# Altium project power.PrjPcb
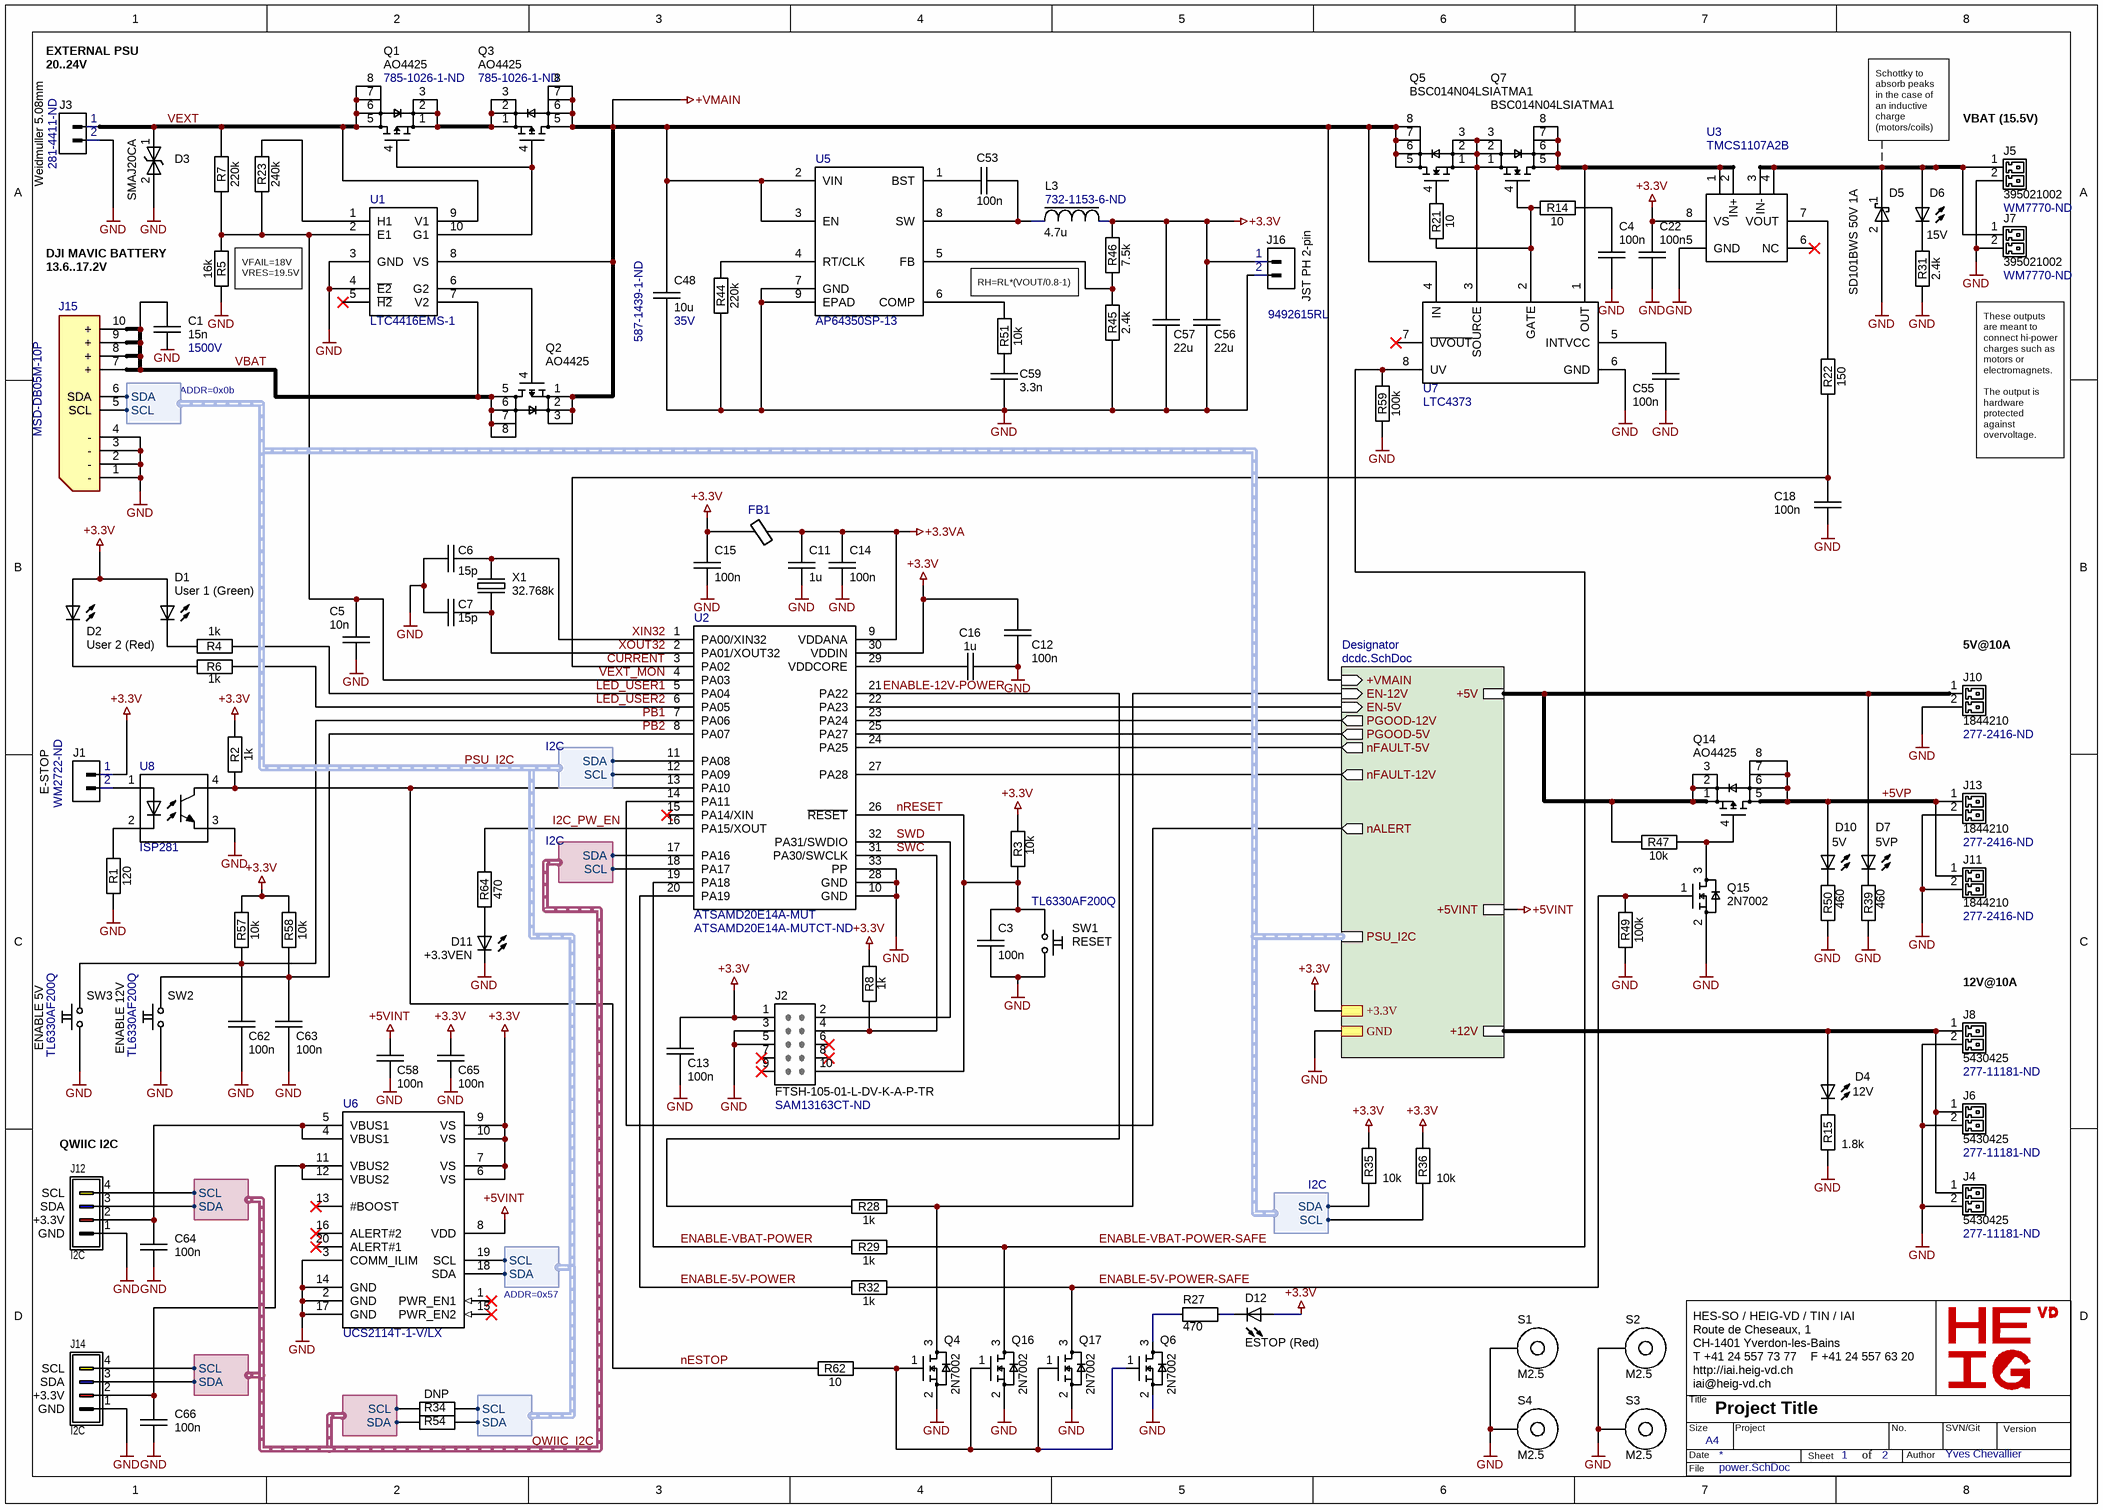
[diagram p0: power.SchDoc]
ProjectAuthor: Prof. Yves Chevallier; ProjectiAi: CRH2022-PWR; ProjectNumber: 165465; ProjectRevision: 0.3.0
2 sheets, 197 parts. Net scope: strictly hierarchical (ports join the sheet entries above them; power ports are local).
Board file: psu.PcbDoc
Sheets:
  power.SchDoc
    Designator = dcdc.SchDoc

## Sheet power.SchDoc: Project Title
size A3; ApprovedBy: Yves Chevallier; CheckedBy: Yves Chevallier; Author: Yves Chevallier; CompanyName: EPFL; DrawnBy: Yves Chevallier; Engineer: Yves Chevallier; Organization: EPFL; Address1: EPFL; Address2: CH1015 Lausanne; Address3: +41(0)21 693 36 98; Address4: +41(0)21 693 26 00; DocumentNumber: ABC.00.0000.000.0; Revision: v1.0; SheetNumber: 1; SheetTotal: 2; DrawnByDate: 2000-01-01; ExecutionWarrantDate: 2000-01-01; ExecutionWarrant: Yves Chevallier; Context: Confidential; PageSetup: Record=PageOptions|CenterHorizontal=True|CenterVertical=False|PrintScale=0.97|XCorrection=1.00|YCorrection=1.00|PrintKind=0|BorderSize=5000000|LeftOffset=0|BottomOffset=0|Orientation=2|PaperLength=1000|PaperWidth=1000|Scale=100|PaperSource=262|PrintQuality=600|MediaType=1|DitherType=10|PaperKind=A4|PrintScaleMode=1; EngineerDate: 2000-01-01; CheckedByDate: 2000-01-01; ProjectName: PRJ

### Parts
C1  15n  Voltage: 1500V  [SM/C1812]
C3  100n  [SM/C0603]
C4  100n  [SM/C0603]
C5  10n  [SM/C0603]
C6  15p  [SM/C0603]
C7  15p  [SM/C0603]
C11  1u  [SM/C0603]
C12  100n  [SM/C0603]
C13  100n  [SM/C0603]
C14  100n  [SM/C0603]
C15  100n  [SM/C0603]
C16  1u  [SM/C0603]
C18  100n  [SM/C0603]
C22  100n  [SM/C0603]
C48  10u  Supplier Part Number 1: 587-1439-1-ND  Voltage: 35V  [SM/C1210]
C53  100n  [SM/C0603]
C55  100n  [SM/C0603]
C56  22u  [SM/C1210]
C57  22u  [SM/C1210]
C58  100n  [SM/C0603]
C59  3.3n  [SM/C0603]
C62  100n  [SM/C0603]
C63  100n  [SM/C0603]
C64  100n  [SM/C0603]
C65  100n  [SM/C0603]
C66  100n  [SM/C0603]
D1  User 1 (Green)  [SM/LED0603]
D2  User 2 (Red)  [SM/LED0603]
D3  SMAJ20CA  [DO214AC]
D4  12V  [SM/LED0603]
D5  SD101BWS 50V 1A  [SOD323]
D6  15V  [SM/LED0603]
D7  5VP  [SM/LED0603]
D10  5V  [SM/LED0603]
D11  +3.3VEN  [SM/LED0603]
D12  ESTOP (Red)  [SM/LED0603]
FB1  250@1MHz  [SM/L0603]  (value not drawn)
J1  E-STOP  Supplier Part Number 1: WM2722-ND  [CONN/HEADER/2.54mm/2POS]
J2  FTSH-105-01-L-DV-K-A-P-TR  Supplier Part Number 1: SAM13163CT-ND  [SAMTEC_FTSH-105-01-L-DV-K-A-P]
J3  Weidmuller 5.08mm  Supplier Part Number 1: 281-4411-ND  [CONN 2POS WEIDMULLER 5.08mm]
J4  5430425  Supplier Part Number 1: 277-11181-ND  [CONN2/PHOENIX/MC 1.5-2-G-3.5-GRAY]
J5  395021002  Supplier Part Number 1: WM7770-ND  [CONN2/PHOENIX/MC 1.5-2-G-3.5-BLACK]
J6  5430425  Supplier Part Number 1: 277-11181-ND  [CONN2/PHOENIX/MC 1.5-2-G-3.5-GRAY]
J7  395021002  Supplier Part Number 1: WM7770-ND  [CONN2/PHOENIX/MC 1.5-2-G-3.5-BLACK]
J8  5430425  Supplier Part Number 1: 277-11181-ND  [CONN2/PHOENIX/MC 1.5-2-G-3.5-GRAY]
J10  1844210  Supplier Part Number 1: 277-2416-ND  [CONN2/PHOENIX/MC 1.5-2-G-3.5]
J11  1844210  Supplier Part Number 1: 277-2416-ND  [CONN2/PHOENIX/MC 1.5-2-G-3.5]
J12  I2C  [QWIIC-SM04B-SRSS-TB]
J13  1844210  Supplier Part Number 1: 277-2416-ND  [CONN2/PHOENIX/MC 1.5-2-G-3.5]
J14  I2C  [QWIIC-SM04B-SRSS-TB]
J15  MSD-DB05M-10P  [CONN DJI-Mavic2]
J16  JST PH 2-pin  Supplier Part Number 1: 9492615RL  [JST_S2B-PH-SM4-TB(LF)(SN)]
L3  4.7u  Supplier Part Number 1: 732-1153-6-ND  [IND_311470_WRE]
Q1  AO4425  Supplier Part Number 1: 785-1026-1-ND  [SOIC8]
Q2  AO4425  [SOIC8]
Q3  AO4425  Supplier Part Number 1: 785-1026-1-ND  [SOIC8]
Q4  2N7002  [SOT23-3]
Q5  BSC014N04LSIATMA1  [PG-TDSON-8_INF]
Q6  2N7002  [SOT23-3]
Q7  BSC014N04LSIATMA1  [PG-TDSON-8_INF]
Q14  AO4425  [SOIC8]
Q15  2N7002  [SOT23-3]
Q16  2N7002  [SOT23-3]
Q17  2N7002  [SOT23-3]
R1  120  [SM/R0603]
R2  1k  [SM/R0603]
R3  10k  [SM/R0603]
R4  1k  [SM/R0603]
R5  16k  [SM/R0603]
R6  1k  [SM/R0603]
R7  220k  [SM/R0603]
R8  1k  [SM/R0603]
R14  10  [SM/R0603]
R15  1.8k  [SM/R0603]
R21  10  [SM/R0603]
R22  150  [SM/R0603]
R23  240k  [SM/R0603]
R27  470  [SM/R0603]
R28  1k  [SM/R0603]
R29  1k  [SM/R0603]
R31  2.4k  [SM/R0603]
R32  1k  [SM/R0603]
R34  DNP  [SM/R0603]  (value not drawn)
R35  10k  [SM/R0603]
R36  10k  [SM/R0603]
R39  460  [SM/R0603]
R44  220k  [SM/R0603]
R45  2.4k  [SM/R0603]
R46  7.5k  [SM/R0603]
R47  10k  [SM/R0603]
R49  100k  [SM/R0603]
R50  460  [SM/R0603]
R51  10k  [SM/R0603]
R54  DNP  [SM/R0603]
R57  10k  [SM/R0603]
R58  10k  [SM/R0603]
R59  100k  [SM/R0603]
R62  10  [SM/R0603]
R64  470  [SM/R0603]
S1  M2.5  [HW/HOLE/M2.5/VIA]  (no BOM)
S2  M2.5  [HW/HOLE/M2.5/VIA]  (no BOM)
S3  M2.5  [HW/HOLE/M2.5/VIA]  (no BOM)
S4  M2.5  [HW/HOLE/M2.5/VIA]  (no BOM)
SW1  RESET  value TL6330AF200Q  [PB TL6330]
SW2  ENABLE 12V  value TL6330AF200Q  [PB TL6330]
SW3  ENABLE 5V  value TL6330AF200Q  [PB TL6330]
U1  LTC4416EMS-1  [MSOP10]
U2  ATSAMD20E14A-MUT  Supplier Part Number 1: ATSAMD20E14A-MUTCT-ND  [QFN32_5X5MC_MCH]
U3  TMCS1107A2B  [SOIC8]
U5  AP64350SP-13  [SOIC8-POWER_PAD]
U6  UCS2114T-1-V/LX  [IC_UCS2114-1-V/LX]
U7  LTC4373  [MSOP8]
U8  ISP281  [SOIC-4]
X1  32.768k  [RT3215-32.768-12.5]

### Sub-sheets
Designator = dcdc.SchDoc: PSU_I2C (harness I2C), nFAULT-5V (out), +VMAIN (in), nFAULT-12V (out), PGOOD-12V (out), PGOOD-5V (out), nALERT (out), +12V, +5V, EN-12V (in), EN-5V (in), +5VINT, +3.3V, GND

### Harnesses
I2C: SDA, SCL
I2C: SCL, SDA

### Nets
+3.3V: C12.2 C13.2 C15.2 C22.2 C56.1 C57.1 C65.2 D1.1 D2.1 D12.1 FB1.2 J1.1 J2.1 J16.1 L3.1 R2.2 R3.2 R8.2 R35.2 R36.2 R46.2 R57.2 R58.2 U2.30(VDDIN) U3.8(VS) U6.6(VS) U6.7(VS) U6.9(VS) U6.10(VS) ; sheet Designator/+3.3V
+3.3VA: C11.2 C14.2 FB1.1 U2.9(VDDANA)
+5V: D7.1 J10.1 Q14.1(S) Q14.2(S) Q14.3(S) R47.2 ; sheet Designator/+5V
+5VINT: C58.2 U6.8(VDD) ; sheet Designator/+5VINT
+12V: D4.1 J4.1 J6.1 J8.1 ; sheet Designator/+12V
+VMAIN: C48.1 Q2.1(S) Q2.2(S) Q2.3(S) Q3.5(D) Q3.6(D) Q3.7(D) Q3.8(D) Q5.5(D) Q5.6(D) Q5.7(D) Q5.8(D) U1.8(VS) U5.2(VIN) U5.3(EN) U7.4(IN) ; sheet Designator/+VMAIN
GND: C1.1 C3.1 C4.1 C5.1 C6.1 C7.1 C11.1 C12.1 C13.1 C14.1 C15.1 C16.1 C18.1 C22.1 C48.2 C55.1 C56.2 C57.2 C58.1 C59.1 C62.1 C63.1 C64.1 C65.1 C66.1 D3.2 D5.2(ANODE) D11.2 J2.3 J2.5 J3.2 J4.2 J5.2 J6.2 J7.2 J8.2 J10.2 J11.2 J12.1(GND) J13.2 J14.1(GND) J15.1(-) J15.2(-) J15.3(-) J15.4(-) J16.2 Q4.2(VCC) Q6.2(VCC) Q15.2(VCC) Q16.2(VCC) Q17.2(VCC) R1.1 R5.1 R15.1 R31.1 R39.1 R44.1 R45.1 R49.1 R50.1 R59.1 S1.1 S2.1 S3.1 S4.1 SW1.1 SW2.1 SW3.1 U1.3(GND) U1.4(~{E2}) U2.10(GND) U2.28(GND) U2.33(PP) U3.5(GND) U5.7(GND) U5.9(EPAD) U6.2(GND) U6.3(COMM_ILIM) U6.14(GND) U6.17(GND) U7.6(GND) U8.3(E) ; sheet Designator/GND
+5VP: D10.1 J11.1 J13.1 Q14.5(D) Q14.6(D) Q14.7(D) Q14.8(D)
CURRENT: C18.2 R22.2 U2.3(PA02)
EN-5V: U2.22(PA23) ; sheet Designator/EN-5V
EN-12V: Q4.3(VCC) R28.1 ; sheet Designator/EN-12V
ENABLE-5V-POWER: R32.2 U2.20(PA19)
ENABLE-5V-POWER-SAFE: Q15.1(VCC) Q17.3(VCC) R32.1 R49.2
ENABLE-12V-POWER: R28.2 U2.21(PA22)
ENABLE-VBAT-POWER: R29.2 U2.19(PA18)
ENABLE-VBAT-POWER-SAFE: Q16.3(VCC) R29.1 R59.2 U7.8(UV)
I2C_PW_EN: R64.2 U2.16(PA15/XOUT)
LED_USER1: R4.1 U2.5(PA04)
LED_USER2: R6.1 U2.6(PA05)
nALERT: U2.14(PA11) ; sheet Designator/nALERT
nESTOP: R2.1 R62.2 U2.13(PA10) U8.4(C)
nFAULT-5V: U2.24(PA25) ; sheet Designator/nFAULT-5V
nFAULT-12V: U2.27(PA28) ; sheet Designator/nFAULT-12V
nRESET: C3.2 J2.10 R3.1 SW1.2 U2.26(~{RESET})
PB1: C62.2 R57.1 SW3.2 U2.7(PA06)
PB2: C63.2 R58.1 SW2.2 U2.8(PA07)
PGOOD-5V: U2.25(PA27) ; sheet Designator/PGOOD-5V
PGOOD-12V: U2.23(PA24) ; sheet Designator/PGOOD-12V
PSU_I2C.SCL: J15.5(SCL) R34.1 R36.1 U2.12(PA09) U6.19(SCL) ; sheet Designator/PSU_I2C.SCL
PSU_I2C.SDA: J15.6(SDA) R35.1 R54.1 U2.11(PA08) U6.18(SDA) ; sheet Designator/PSU_I2C.SDA
QWIIC_I2C.SCL: J12.4(SCL) J14.4(SCL) R34.2 U2.18(PA17) ; harness I2C.SCL
QWIIC_I2C.SDA: J12.3(SDA) J14.3(SDA) R54.2 U2.17(PA16) ; harness I2C.SDA
SWC: J2.4 R8.1 U2.31(PA30/SWCLK)
SWD: J2.2 U2.32(PA31/SWDIO)
VBAT: C1.2 J15.7(+) J15.8(+) J15.9(+) J15.10(+) Q2.5(D) Q2.6(D) Q2.7(D) Q2.8(D) U1.7(V2)
VEXT: D3.1 J3.1 Q1.5(D) Q1.6(D) Q1.7(D) Q1.8(D) R7.2 U1.9(V1)
VEXT_MON: C5.2 R5.2 R7.1 R23.1 U1.2(E1) U2.4(PA03)
XIN32: C6.2 U2.1(PA00/XIN32) X1.2
XOUT32: C7.2 U2.2(PA01/XOUT32) X1.1
NetC4_2: C4.2 R14.1
NetC16_2: C16.2 U2.29(VDDCORE)
NetC53_1: C53.1 U5.1(BST)
NetC53_2: C53.2 L3.2 U5.8(SW)
NetC55_2: C55.2 U7.5(INTVCC)
NetC59_2: C59.2 R51.1
NetC64_2: C64.2 J12.2(+3.3V) U6.4(VBUS1) U6.5(VBUS1)
NetC66_2: C66.2 J14.2(+3.3V) U6.11(VBUS2) U6.12(VBUS2)
NetD1_2: D1.2 R4.2
NetD2_2: D2.2 R6.2
NetD4_2: D4.2 R15.2
NetD5_1: D5.1(CATHODE) D6.1 J5.1 J7.1 U3.3(IN-) U3.4(IN-)
NetD6_2: D6.2 R31.2
NetD7_2: D7.2 R39.2
NetD10_2: D10.2 R50.2
NetD11_1: D11.1 R64.1
NetD12_2: D12.2 R27.1
NetJ1_2: J1.2 U8.1(A)
NetQ1_1: Q1.1(S) Q1.2(S) Q1.3(S) Q3.1(S) Q3.2(S) Q3.3(S)
NetQ1_4: Q1.4(Gate) Q3.4(Gate) U1.10(G1)
NetQ2_4: Q2.4(Gate) U1.6(G2)
NetQ4_1: Q4.1(VCC) Q6.1(VCC) Q16.1(VCC) Q17.1(VCC) R62.1
NetQ5_1: Q5.1(S) Q5.2(S) Q5.3(S) Q7.1(S) Q7.2(S) Q7.3(S) U7.3(SOURCE)
NetQ5_4: Q5.4(Gate) R21.2
NetQ6_3: Q6.3(VCC) R27.2
NetQ7_4: Q7.4(Gate) R14.2 R21.1 U7.2(GATE)
NetQ7_5: Q7.5(D) Q7.6(D) Q7.7(D) Q7.8(D) U3.1(IN+) U3.2(IN+) U7.1(OUT)
NetQ14_4: Q14.4(Gate) Q15.3(VCC) R47.1
NetR1_2: R1.2 U8.2(K)
NetR22_1: R22.1 U3.7(VOUT)
NetR23_2: R23.2 U1.1(H1)
NetR44_2: R44.2 U5.4(RT/CLK)
NetR45_2: R45.2 R46.1 U5.5(FB)
NetR51_2: R51.2 U5.6(COMP)

Not connected (* = marked no-connect by the designer): J2 6* 7* 8* 9*; U1 5(~{H2})*; U2 15(PA14/XIN)*; U3 6(NC)*; U6 1(PWR_EN1)* 13(#BOOST)* 15(PWR_EN2)* 16(ALERT#2)* 20(ALERT#1)*; U7 7(~{UVOUT})*

### Buses and harness runs
harness PSU_I2C = sheet Designator/PSU_I2C

### Notes on the sheet
- EXTERNAL PSU
- 20..24V
- Schottky to absorb peaks in the case of an inductive charge (motors/coils)
- (near J5) VBAT (15.5V)
- DJI MAVIC BATTERY
- 13.6..17.2V
- (near R5) VFAIL=18V
  VRES=19.5V
- RH=RL*(VOUT/0.8-1)
- (near C1) ADDR=0x0b
- These outputs are meant to connect hi-power charges such as motors or electromagnets.
  The output is hardware protected against overvoltage.
- (near J10) 5V@10A
- (near J8) 12V@10A
- (near J12) QWIIC I2C
- (near U6) ADDR=0x57
- HES-SO / HEIG-VD / TIN / IAI
  Route de Cheseaux, 1
  CH-1401 Yverdon-les-Bains
  T +41 24 557 73 77    F +41 24 557 63 20
  http://iai.heig-vd.ch
  iai@heig-vd.ch
- Title
- Size
- Date
- A4
- Project
- Sheet
- of
- No.
- Author
- SVN/Git
- Version
- File

### Library data of the parts
C1 = C: 0.015 µF ±10% 1500V (1.5kV) Ceramic Capacitor X7R 1812 (4532 Metric); Dielectric: X7R; Supplier 1: Digi-Key; Supplier Part Number 1: 478-10711-1-ND; Value: 15n
C3 C5-C7 C11-C16 C58 C62-C66 = C: Chip Capacitor; Voltage: 16V; Dielectric: X7R
  C3 C13 C64 C66: Value: 100n
  C5: Value: 10n
  C6 C7: Value: 15p
  C11: Supplier 2 Part Number: 1292-1393-1-ND; Supplier 2: Digi-Key; Value: 1u
  C12 C14 C15 C58 C62 C63 C65: Supplier 2 Part Number: 1292-1393-1-ND; Supplier 2: Digi-Key; Value: 100n
  C16: Value: 1u
C4 C18 C22 C53 C55 C59 = C: CL32B226KPJVPNE; Supplier 1: Digi-Key; Supplier Part Number 1: 490-1719-1-ND
  C4 C18 C22 C53 C55: Value: 100n
  C59: Value: 3.3n
C48 = C: 10µF ±10% 25V Ceramic Capacitor X5R 1210 (3225 Metric); Rule: UNIONINDEX=0|RULEKIND=PolygonConnect|NETSCOPE=AnyNet|LAYERKIND=SameLayer|NAME=Schematic Polygon Connect Style|CONNECTSTYLE=Relief|RELIEFCONDUCTORWIDTH=39.3701mil|RELIEFENTRIES=4|POLYGONRELIEFANGLE=90 Angle|AIRGAPWIDTH=5.9055mil|UNIT=Metric; Value: GMK325BJ106KN-T; Supplier 1: Digi-Key
C56 C57 = C: CL32B226KPJVPNE; Rule: UNIONINDEX=0|RULEKIND=PolygonConnect|NETSCOPE=AnyNet|LAYERKIND=SameLayer|NAME=Schematic Polygon Connect Style|CONNECTSTYLE=Relief|RELIEFCONDUCTORWIDTH=39.3701mil|RELIEFENTRIES=4|POLYGONRELIEFANGLE=90 Angle|AIRGAPWIDTH=5.9055mil|UNIT=Metric; Supplier 1: Digi-Key; Supplier Part Number 1: 490-1719-1-ND; Value: 22u
D1 D4 D6 D7 D10 D11 = LED: Value: 150060SS75000
  D1: Color: Green
  D4 D6 D7 D10: Supplier 1: Digi-Key; Supplier Part Number 1: 732-4979-1-ND
  D11: Supplier 1: Digi-Key; Supplier Part Number 1: 492-1325-1-ND
D2 D12 = LED: Value: SM0603URC; Supplier 1: Digi-Key; Supplier Part Number 1: 492-1326-1-ND; Color: Red
D3 = D TVS: 32.4V Clamp 12.3A Ipp Tvs Diode Surface Mount DO-214AC (SMA); Supplier 1: Digi-Key; Supplier Part Number 1: SMAJ20CA-E3/61GICT-ND; Value: SMAJ20CA
D5 = D SCHOTTKY CUS520: Diode Schottky 30V 200mA Surface Mount USC; Value: SD101BWS-TP; Supplier 1: Digi-Key; Supplier Part Number 1: SD101BWSTPMSCT-ND
FB1 = FB0603: Value: MI0603L301R-10; Supplier 1: Digi-Key; Supplier Part Number 1: 240-2374-1-ND
J1 = CONN 2 MALE: Value: CONN 2.54; Supplier 1: Digi-Key
J2 = CONN 10 (2x5): Connector Header Surface Mount 10 position 0.050" (1.27mm); Supplier 1: Digi-Key
J3 = CONN 2 MALE: TERM BLOCK HDR 2POS 90DEG 5.08MM; Value: 1241060000; Rule: UNIONINDEX=0|RULEKIND=PolygonConnect|NETSCOPE=AnyNet|LAYERKIND=SameLayer|NAME=Schematic Polygon Connect Style|CONNECTSTYLE=Relief|RELIEFCONDUCTORWIDTH=39.3701mil|RELIEFENTRIES=4|POLYGONRELIEFANGLE=90 Angle|AIRGAPWIDTH=5.9055mil|UNIT=Metric; Supplier 1: Digi-Key
J4 J6 J8 J10 J11 J13 = CONN 2 PHOENIX 3.5 mm: TERM BLOCK HDR 2POS 90DEG 3.5MM; Imax: 8A; Rule: UNIONINDEX=0|RULEKIND=PolygonConnect|NETSCOPE=AnyNet|LAYERKIND=SameLayer|NAME=Schematic Polygon Connect Style|CONNECTSTYLE=Relief|RELIEFCONDUCTORWIDTH=39.3701mil|RELIEFENTRIES=4|POLYGONRELIEFANGLE=90 Angle|AIRGAPWIDTH=5.9055mil|UNIT=Metric; Supplier 1: Digi-Key
  J4 J6 J8: Value: 5430425
  J10 J11 J13: Value: 1844210
J5 J7 = CONN 2 PHOENIX 3.5 mm: TERM BLOCK HDR 2POS 90DEG 3.5MM BLACK; Imax: 8A; Rule: UNIONINDEX=0|RULEKIND=PolygonConnect|NETSCOPE=AnyNet|LAYERKIND=SameLayer|NAME=Schematic Polygon Connect Style|CONNECTSTYLE=Relief|RELIEFCONDUCTORWIDTH=39.3701mil|RELIEFENTRIES=4|POLYGONRELIEFANGLE=90 Angle|AIRGAPWIDTH=5.9055mil|UNIT=Metric; Supplier 1: Digi-Key; Value: 395021002
J12 J14 = CONN 4/QWIIC: JST Sparkfun Qwiic Connector; Value: Sparkfun Qwiic
J15 = CONN DJI 10POS: Value: MSD-DB05M-10P
J16 = CONN 2 MALE: Value: JST S2BPHSM4TBLFSN; Rule: UNIONINDEX=0|RULEKIND=PolygonConnect|NETSCOPE=AnyNet|LAYERKIND=SameLayer|NAME=Schematic Polygon Connect Style|CONNECTSTYLE=Relief|RELIEFCONDUCTORWIDTH=39.3701mil|RELIEFENTRIES=4|POLYGONRELIEFANGLE=90 Angle|AIRGAPWIDTH=5.9055mil|UNIT=Metric; Supplier 1: Farnell
L3 = L: FIXED IND 4.7UH 6A 19.5 MOHM SMD; Value: 744311470; Rule: UNIONINDEX=0|RULEKIND=PolygonConnect|NETSCOPE=AnyNet|LAYERKIND=SameLayer|NAME=Schematic Polygon Connect Style|CONNECTSTYLE=Relief|RELIEFCONDUCTORWIDTH=39.3701mil|RELIEFENTRIES=4|POLYGONRELIEFANGLE=45 Angle|AIRGAPWIDTH=5.9055mil|UNIT=Metric; Isat: *; Supplier 1: Digi-Key
Q1-Q3 Q14 = AO4425: P-Channel 38 V 14A (Ta) 3.1W (Ta) Surface Mount 8-SOIC; Rule: UNIONINDEX=0|RULEKIND=PolygonConnect|NETSCOPE=AnyNet|LAYERKIND=SameLayer|NAME=Schematic Polygon Connect Style|CONNECTSTYLE=Relief|RELIEFCONDUCTORWIDTH=15.748mil|RELIEFENTRIES=4|POLYGONRELIEFANGLE=90 Angle|AIRGAPWIDTH=5.9055mil|UNIT=Metric; Value: AO4425; Supplier 1: Digi-Key
  Q2 Q14: Supplier Part Number 1: 785-1026-1-ND
Q4 Q6 Q15-Q17 = 2N7002: MOSFET N-CH 60V 115MA SOT323; Value: 2N7002; Supplier 1: Digi-Key; Supplier Part Number 1: 2N7002H6327XTSA2CT-ND
Q5 Q7 = BSC0502NSIATMA1: MOSFET N-CH 40V 31A/100A TDSON; Rule: UNIONINDEX=0|RULEKIND=PolygonConnect|NETSCOPE=AnyNet|LAYERKIND=SameLayer|NAME=Schematic Polygon Connect Style|CONNECTSTYLE=Relief|RELIEFCONDUCTORWIDTH=11.811mil|RELIEFENTRIES=4|POLYGONRELIEFANGLE=90 Angle|AIRGAPWIDTH=5.9055mil|UNIT=Metric; Value: BSC014N04LSIATMA1; Supplier 1: Digi-Key; Supplier Part Number 1: BSC014N04LSIATMA1CT-ND
R1-R8 R14 R15 R21-R23 R27-R29 R31 R32 R34-R36 R39 R44-R47 R49-R51 R54 R57-R59 R62 R64 = R: Chip Resistor SMD
  R1: Value: 120
  R2 R4 R6 R8 R28 R29 R32: Value: 1k
  R3 R35 R36 R47 R51 R57 R58: Value: 10k
  R5: Value: 16k
  R7 R44: Value: 220k
  R14 R21 R62: Value: 10
  R15: Value: 1.8k
  R22: Value: 150
  R23: Value: 240k
  R27 R64: Value: 470
  R31 R45: Value: 2.4k
  R34 R54: Value: DNP
  R39 R50: Value: 460
  R46: Value: 7.5k
  R49 R59: Value: 100k
S1-S4 = HOLE/M2.5
SW1-SW3 = SWTICH (1)
  SW1 SW3: Supplier 1: Digi-Key; Supplier Part Number 1: EG5546CT-ND
  SW2: Supplier 1: TI store; Supplier Part Number 1: TL751M12QKTTRQ1
U1 = LTC4416: IC OR CTRLR SRC SELECT 10MSOP; Supplier 1: Digi-Key; Value: LTC4416EMS-1; Supplier Part Number 1: 505-LTC4416EMS-1#PBF-ND
U2 = MCU/ATSAMD20E14A-MUT: ARM® Cortex®-M0+ SAM D20E Microcontroller IC 32-Bit 48MHz 16KB (16K x 8) FLASH 32-QFN (5x5); Supplier 1: Digi-Key; Value: ATSAMD20E14A-MUT
U3 = TMCS1107A: AEC-Q100, 420-V ISOLATED HALL-EF; Rule: UNIONINDEX=0|RULEKIND=PolygonConnect|NETSCOPE=AnyNet|LAYERKIND=SameLayer|NAME=Schematic Polygon Connect Style|CONNECTSTYLE=Relief|RELIEFCONDUCTORWIDTH=19.685mil|RELIEFENTRIES=4|POLYGONRELIEFANGLE=90 Angle|AIRGAPWIDTH=5.9055mil|UNIT=Metric; Supplier 1: Digi-Key; Value: TMCS1107A2B; Supplier Part Number 1: 296-TMCS1107A2BQDRQ1CT-ND
U5 = AP64350: Buck Switching Regulator IC Positive Adjustable 0.8V 1 Output 3.5A 8-SOIC (0.154", 3.90mm Width) Exposed Pad; Supplier 1: Avnet; Supplier Part Number 1: AP64350SP-13; Value: AP64350SP-13
U6 = UCS2114T-1-V: Power Switch/Driver 1:1 - 3A 20-VQFN (3x3); Value: UCS2114T-1-V/LX; Supplier 1: Digi-Key; Supplier Part Number 1: UCS2114T-1-V/LXCT-ND
U7 = LTC4373: LOW ICC IDEAL DIODE CONTROLLER W; Value: LTC4373; Supplier 1: Digi-Key; Supplier Part Number 1: 161-LTC4373IMS8#PBF-ND
U8 = ISP281: OPTOISOLATR 5KV TRANSISTOR 4-SMD; Value: ISP281; Supplier 1: Digi-Key; Supplier Part Number 1: 58-ISP281DCT-ND
X1 = XTAL: Value: RT3215-32.768-12.5; Supplier 1: Digi-Key; Supplier Part Number 1: 2151-RT3215-32.768-12.5-TRCT-ND

## Sheet dcdc.SchDoc
size A3; SheetNumber: 2; SheetTotal: 2
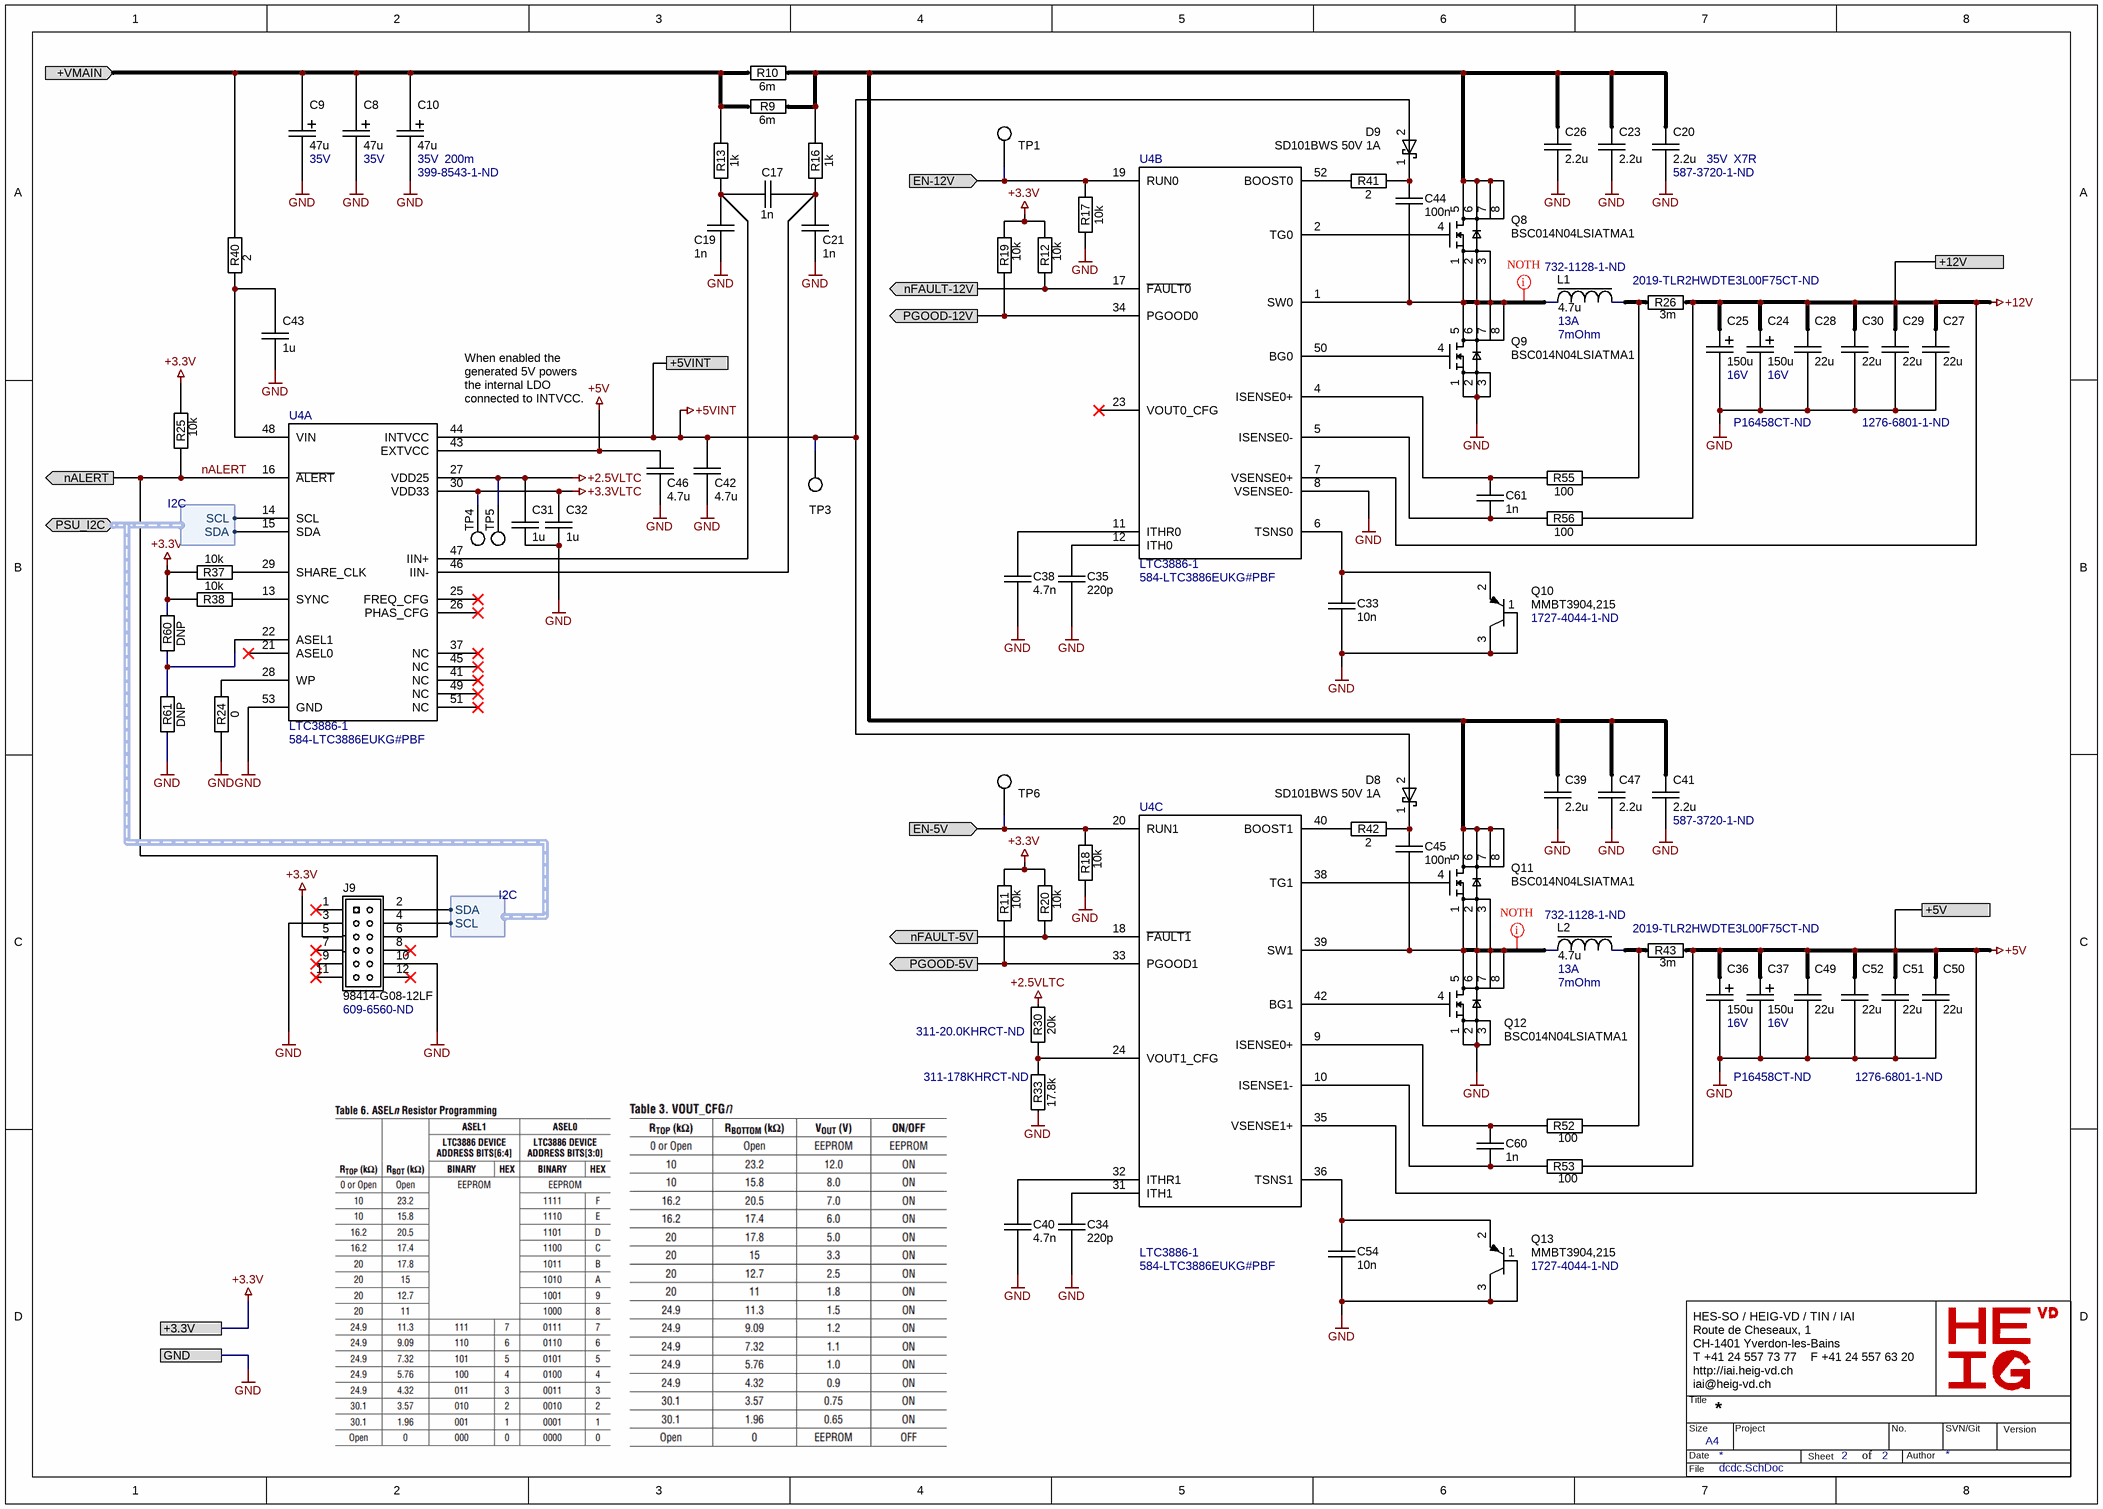
[diagram p1: dcdc.SchDoc]

### Parts
C8  47u  Voltage: 35V  [CAP-TANTAL-2917-7343]
C9  47u  Voltage: 35V  [CAP-TANTAL-2917-7343]
C10  47u  Supplier Part Number 1: 399-8543-1-ND  Voltage: 35V  ESR: 200m  [CAP-TANTAL-2917-7343]
C17  1n  [SM/C0603]
C19  1n  [SM/C0603]
C20  2.2u  Voltage: 35V  Dielectric: X7R  Supplier Part Number 1: 587-3720-1-ND  [SM/C1210]
C21  1n  [SM/C0603]
C23  2.2u  [SM/C1210]
C24  150u  Voltage: 16V  Supplier Part Number 1: P16458CT-ND  [CAP_16SVP150M]
C25  150u  Voltage: 16V  [CAP_16SVP150M]
C26  2.2u  [SM/C1210]
C27  22u  Supplier Part Number 1: 1276-6801-1-ND  [SM/C1210]
C28  22u  [SM/C1210]
C29  22u  [SM/C1210]
C30  22u  [SM/C1210]
C31  1u  [SM/C0603]
C32  1u  [SM/C0603]
C33  10n  [SM/C0603]
C34  220p  [SM/C0603]
C35  220p  [SM/C0603]
C36  150u  Voltage: 16V  [CAP_16SVP150M]
C37  150u  Voltage: 16V  Supplier Part Number 1: P16458CT-ND  [CAP_16SVP150M]
C38  4.7n  [SM/C0603]
C39  2.2u  [SM/C1210]
C40  4.7n  [SM/C0603]
C41  2.2u  Supplier Part Number 1: 587-3720-1-ND  [SM/C1210]
C42  4.7u  [SM/C0603]
C43  1u  [SM/C0603]
C44  100n  [SM/C0603]
C45  100n  [SM/C0603]
C46  4.7u  [SM/C0603]
C47  2.2u  [SM/C1210]
C49  22u  [SM/C1210]
C50  22u  Supplier Part Number 1: 1276-6801-1-ND  [SM/C1210]
C51  22u  [SM/C1210]
C52  22u  [SM/C1210]
C54  10n  [SM/C0603]
C60  1n  [SM/C0603]
C61  1n  [SM/C0603]
D8  SD101BWS 50V 1A  [SOD323]
D9  SD101BWS 50V 1A  [SOD323]
J9  98414-G08-12LF  Supplier Part Number 1: 609-6560-ND  [CONN14 2mm]
L1  4.7u  Supplier Part Number 1: 732-1128-1-ND  Imax: 13A  Rs: 7mOhm  [WE-7443551470]
L2  4.7u  Supplier Part Number 1: 732-1128-1-ND  Imax: 13A  Rs: 7mOhm  [WE-7443551470]
Q8  BSC014N04LSIATMA1  [PG-TDSON-8_INF]
Q9  BSC014N04LSIATMA1  [PG-TDSON-8_INF]
Q10  MMBT3904,215  Supplier Part Number 1: 1727-4044-1-ND  [SOT23-3]
Q11  BSC014N04LSIATMA1  [PG-TDSON-8_INF]
Q12  BSC014N04LSIATMA1  [PG-TDSON-8_INF]
Q13  MMBT3904,215  Supplier Part Number 1: 1727-4044-1-ND  [SOT23-3]
R9  6m  [SM/R1206]
R10  6m  [SM/R1206]
R11  10k  [SM/R0603]
R12  10k  [SM/R0603]
R13  1k  [SM/R0603]
R16  1k  [SM/R0603]
R17  10k  [SM/R0603]
R18  10k  [SM/R0603]
R19  10k  [SM/R0603]
R20  10k  [SM/R0603]
R24  0  [SM/R0603]
R25  10k  [SM/R0603]
R26  3m  [SM/R2010]
R30  20k  Supplier Part Number 1: 311-20.0KHRCT-ND  [SM/R0603]
R33  17.8k  Supplier Part Number 1: 311-178KHRCT-ND  [SM/R0603]
R37  10k  [SM/R0603]
R38  10k  [SM/R0603]
R40  2  [SM/R0603]
R41  2  [SM/R0603]
R42  2  [SM/R0603]
R43  3m  [SM/R2010]
R52  100  [SM/R0603]
R53  100  [SM/R0603]
R55  100  [SM/R0603]
R56  100  [SM/R0603]
R60  DNP  [SM/R0603]
R61  DNP  [SM/R0603]
TP1  TP  [TP/0.6]  (value not drawn)  (no BOM)
TP3  TP  [TP/0.6]  (value not drawn)  (no BOM)
TP4  TP  [TP/0.6]  (value not drawn)  (no BOM)
TP5  TP  [TP/0.6]  (value not drawn)  (no BOM)
TP6  TP  [TP/0.6]  (value not drawn)  (no BOM)
U4  LTC3886-1  Supplier Part Number 1: 584-LTC3886EUKG#PBF  [LT3886]  (parts A,B,C of 3)

### Ports
+3.3V, +5V, +5VINT, +12V, +VMAIN (in), EN-5V (in), EN-12V (in), GND, nALERT (out), nFAULT-5V (out), nFAULT-12V (out), PGOOD-5V (out), PGOOD-12V (out), PSU_I2C (bidir, harness I2C)

### Harnesses
I2C: SDA, SCL

### Nets
+2.5VLTC: C31.1 R30.2 TP5.1 U4.27(VDD25)
+3.3V: J9.5 R11.2 R12.2 R19.2 R20.2 R25.2 R37.2 R38.2 R60.1 ; port +3.3V
+3.3VLTC: C32.1 TP4.1 U4.30(VDD33)
+5V: C36.1(+) C37.1(+) C46.1 C49.1 C50.1 C51.1 C52.1 R43.1 R53.2 U4.35(VSENSE1+) U4.43(EXTVCC) ; port +5V
+5VINT: C42.1 D8.2(ANODE) D9.2(ANODE) TP3.1 U4.44(INTVCC) ; port +5VINT
+12V: C24.1(+) C25.1(+) C27.1 C28.1 C29.1 C30.1 R26.1 R56.2 U4.7(VSENSE0+) ; port +12V
+VMAIN: C8.1(+) C9.1(+) C10.1(+) R9.1 R10.1 R13.2 R40.2 ; port +VMAIN
GND: C8.2(-) C9.2(-) C10.2(-) C19.2 C20.1 C21.2 C23.1 C24.2(-) C25.2(-) C26.1 C27.2 C28.2 C29.2 C30.2 C31.2 C32.2 C33.2 C34.2 C35.2 C36.2(-) C37.2(-) C38.2 C39.1 C40.2 C41.1 C42.2 C43.2 C46.2 C47.1 C49.2 C50.2 C51.2 C52.2 C54.2 J9.3 J9.10 Q9.1(S) Q9.2(S) Q9.3(S) Q10.1(B) Q10.3(C) Q12.1(S) Q12.2(S) Q12.3(S) Q13.1(B) Q13.3(C) R17.1 R18.1 R24.2 R33.1 R61.2 U4.8(VSENSE0-) U4.53(GND) ; port GND
EN-5V: R18.2 TP6.1 U4.20(RUN1) ; port EN-5V
EN-12V: R17.2 TP1.1 U4.19(RUN0) ; port EN-12V
nALERT: J9.6 R25.1 U4.16(~{ALERT}) ; port nALERT
nFAULT-5V: R20.1 U4.18(~{FAULT1}) ; port nFAULT-5V
nFAULT-12V: R12.1 U4.17(~{FAULT0}) ; port nFAULT-12V
PGOOD-5V: R11.1 U4.33(PGOOD1) ; port PGOOD-5V
PGOOD-12V: R19.1 U4.34(PGOOD0) ; port PGOOD-12V
PSU_I2C.SCL: J9.4 U4.14(SCL) ; port PSU_I2C.SCL
PSU_I2C.SDA: J9.2 U4.15(SDA) ; port PSU_I2C.SDA
NetC17_1: C17.1 C19.1 R13.1 U4.47(IIN+)
NetC17_2: C17.2 C21.1 R16.1 U4.46(IIN-)
NetC20_2: C20.2 C23.2 C26.2 C39.2 C41.2 C47.2 Q8.5(D) Q8.6(D) Q8.7(D) Q8.8(D) Q11.5(D) Q11.6(D) Q11.7(D) Q11.8(D) R9.2 R10.2 R16.2
NetC33_1: C33.1 Q10.2(E) U4.6(TSNS0)
NetC34_1: C34.1 U4.31(ITH1)
NetC35_1: C35.1 U4.12(ITH0)
NetC38_1: C38.1 U4.11(ITHR0)
NetC40_1: C40.1 U4.32(ITHR1)
NetC43_1: C43.1 R40.1 U4.48(VIN)
NetC44_1: C44.1 D9.1(CATHODE) R41.2
NetC44_2: C44.2 L1.2 Q8.1(S) Q8.2(S) Q8.3(S) Q9.5(D) Q9.6(D) Q9.7(D) Q9.8(D) U4.1(SW0)
NetC45_1: C45.1 D8.1(CATHODE) R42.2
NetC45_2: C45.2 L2.2 Q11.1(S) Q11.2(S) Q11.3(S) Q12.5(D) Q12.6(D) Q12.7(D) Q12.8(D) U4.39(SW1)
NetC54_1: C54.1 Q13.2(E) U4.36(TSNS1)
NetC60_1: C60.1 R52.1 U4.9(ISENSE0+)
NetC60_2: C60.2 R53.1 U4.10(ISENSE1-)
NetC61_1: C61.1 R55.1 U4.4(ISENSE0+)
NetC61_2: C61.2 R56.1 U4.5(ISENSE0-)
NetL1_1: L1.1 R26.2 R55.2
NetL2_1: L2.1 R43.2 R52.2
NetQ8_4: Q8.4(Gate) U4.2(TG0)
NetQ9_4: Q9.4(Gate) U4.50(BG0)
NetQ11_4: Q11.4(Gate) U4.38(TG1)
NetQ12_4: Q12.4(Gate) U4.42(BG1)
NetR24_1: R24.1 U4.28(WP)
NetR30_1: R30.1 R33.2 U4.24(VOUT1_CFG)
NetR37_1: R37.1 U4.29(SHARE_CLK)
NetR38_1: R38.1 U4.13(SYNC)
NetR41_1: R41.1 U4.52(BOOST0)
NetR42_1: R42.1 U4.40(BOOST1)
NetR60_2: R60.2 R61.1 U4.22(ASEL1)

Not connected (* = marked no-connect by the designer): J9 1* 7* 8* 9* 11* 12*; U4 21(ASEL0)* 23(VOUT0_CFG)* 25(FREQ_CFG)* 26(PHAS_CFG)* 37(NC)* 41(NC)* 45(NC)* 49(NC)* 51(NC)*

### Layout directives
rule Polygon Connect Style [Style - Direct Connect]: NetC44_2, NetC45_2

### Notes on the sheet
- (near U4) When enabled the generated 5V powers the internal LDO connected to INTVCC.
- HES-SO / HEIG-VD / TIN / IAI
  Route de Cheseaux, 1
  CH-1401 Yverdon-les-Bains
  T +41 24 557 73 77    F +41 24 557 63 20
  http://iai.heig-vd.ch
  iai@heig-vd.ch
- Title
- Size
- Date
- A4
- Project
- Sheet
- of
- No.
- Author
- SVN/Git
- Version
- File

### Library data of the parts
C8 C9 = C+2312: 47µF Molded Tantalum Capacitors 25V 2917 (7343 Metric) 900mOhm; Rule: UNIONINDEX=0|RULEKIND=PolygonConnect|NETSCOPE=AnyNet|LAYERKIND=SameLayer|NAME=Schematic Polygon Connect Style|CONNECTSTYLE=Relief|RELIEFCONDUCTORWIDTH=39.3701mil|RELIEFENTRIES=4|POLYGONRELIEFANGLE=90 Angle|AIRGAPWIDTH=5.9055mil|UNIT=Metric; ESR: 200m; Supplier 1: Digi-Key; Supplier Part Number 1: 399-8543-1-ND; Value: 47u
C10 = C+2312: 47µF Molded Tantalum Capacitors 25V 2917 (7343 Metric) 900mOhm; Rule: UNIONINDEX=0|RULEKIND=PolygonConnect|NETSCOPE=AnyNet|LAYERKIND=SameLayer|NAME=Schematic Polygon Connect Style|CONNECTSTYLE=Relief|RELIEFCONDUCTORWIDTH=39.3701mil|RELIEFENTRIES=4|POLYGONRELIEFANGLE=90 Angle|AIRGAPWIDTH=5.9055mil|UNIT=Metric; Supplier 1: Digi-Key; Value: 47u
C17 C19 C21 C31-C35 C38 C40 C42-C46 C54 C60 C61 = C: as C3 on sheet power
  C17 C60: Supplier 2 Part Number: 1292-1393-1-ND; Supplier 2: Digi-Key; Value: 1n
  C19 C21 C61: Value: 1n
  C31 C32: Value: 1u
  C33: Supplier 2 Part Number: 1292-1393-1-ND; Supplier 2: Digi-Key; Value: 10n
  C34 C35: Supplier 2 Part Number: 1292-1393-1-ND; Supplier 2: Digi-Key; Value: 220p
  C38 C40: Supplier 2 Part Number: 1292-1393-1-ND; Supplier 2: Digi-Key; Value: 4.7n
  C42 C46: Value: 4.7u
  C43: Supplier 2 Part Number: 1292-1393-1-ND; Supplier 2: Digi-Key; Value: 1u
  C44 C45: Supplier 2 Part Number: 1292-1393-1-ND; Supplier 2: Digi-Key; Value: 100n
  C54: Value: 10n
C20 C23 C26 = C: GMK325B7225KNHT CAP CER 2.2UF 35V X7R 1210; Rule: UNIONINDEX=0|RULEKIND=PolygonConnect|NETSCOPE=AnyNet|LAYERKIND=SameLayer|NAME=Schematic Polygon Connect Style|CONNECTSTYLE=Relief|RELIEFCONDUCTORWIDTH=39.3701mil|RELIEFENTRIES=4|POLYGONRELIEFANGLE=90 Angle|AIRGAPWIDTH=5.9055mil|UNIT=Metric; Supplier 1: Digi-Key; Value: GMK325B7225KNHT
  C23 C26: Voltage: 35V; Dielectric: X7R; Supplier Part Number 1: 587-3720-1-ND
C24 C25 C36 C37 = C+2312: CAP ALUM POLY 150UF 20% 16V SMD; Rule: UNIONINDEX=0|RULEKIND=PolygonConnect|NETSCOPE=AnyNet|LAYERKIND=SameLayer|NAME=Schematic Polygon Connect Style|CONNECTSTYLE=Relief|RELIEFCONDUCTORWIDTH=39.3701mil|RELIEFENTRIES=4|POLYGONRELIEFANGLE=90 Angle|AIRGAPWIDTH=5.9055mil|UNIT=Metric; Value: 16SVP150M; Supplier 1: Digi-Key
  C25 C36: Supplier Part Number 1: P16458CT-ND
C27-C29 C49-C52 = C: CL32B226KOJVPJE CAP CER 22UF 16V X7R 1210; Rule: UNIONINDEX=0|RULEKIND=PolygonConnect|NETSCOPE=AnyNet|LAYERKIND=SameLayer|NAME=Schematic Polygon Connect Style|CONNECTSTYLE=Relief|RELIEFCONDUCTORWIDTH=39.3701mil|RELIEFENTRIES=4|POLYGONRELIEFANGLE=90 Angle|AIRGAPWIDTH=5.9055mil|UNIT=Metric; Supplier 1: Digi-Key; Value: 22u
  C28 C29 C49 C51 C52: Supplier Part Number 1: 1276-6801-1-ND
C30 = C: CL32B226KOJVPJE CAP CER 22UF 16V X7R 1210; Rule: UNIONINDEX=0|RULEKIND=PolygonConnect|NETSCOPE=AnyNet|LAYERKIND=SameLayer|NAME=Schematic Polygon Connect Style|THPAD.CONNECTSTYLE=Relief|THPAD.RELIEFCONDUCTORWIDTH=39.3701mil|THPAD.RELIEFENTRIES=4|THPAD.POLYGONRELIEFANGLE=90 Angle|THPAD.AIRGAPWIDTH=5.9055mil|SMDPAD.CONNECTSTYLE=Relief|SMDPAD.RELIEFCONDUCTORWIDTH=39.3701mil|SMDPAD.RELIEFENTRIES=4|SMDPAD.POLYGONRELIEFANGLE=90 Angle|SMDPAD.AIRGAPWIDTH=5.9055mil|VIA.CONNECTSTYLE=Direct|VIA.RELIEFCONDUCTORWIDTH=10mil|VIA.RELIEFENTRIES=4|VIA.POLYGONRELIEFANGLE=45 Angle|VIA.AIRGAPWIDTH=10mil|UNIT=Metric; Supplier 1: Digi-Key; Supplier Part Number 1: 1276-6801-1-ND; Value: 22u
C39 C41 C47 = C: GMK325B7225KNHT CAP CER 2.2UF 35V X7R 1210; Voltage: 16V; Rule: UNIONINDEX=0|RULEKIND=PolygonConnect|NETSCOPE=AnyNet|LAYERKIND=SameLayer|NAME=Schematic Polygon Connect Style|CONNECTSTYLE=Relief|RELIEFCONDUCTORWIDTH=39.3701mil|RELIEFENTRIES=4|POLYGONRELIEFANGLE=90 Angle|AIRGAPWIDTH=5.9055mil|UNIT=Metric; Dielectric: X7R; Supplier 2 Part Number: 1292-1393-1-ND; Supplier 2: Digi-Key; Supplier 1: Digi-Key; Value: 2.2u
  C39 C47: Supplier Part Number 1: 587-3720-1-ND
D8 D9 = D SCHOTTKY CUS520: as D5 on sheet power; Supplier 1: Digi-Key; Supplier Part Number 1: SD101BWSTPMSCT-ND
J9 = CONN 12: CONN HEADER VERT 12POS 2MM; Supplier 1: Digi-Key; Value: 98414-G08-12LF
L1 L2 = L: FIXED IND 4.7UH 13A 7 MOHM SMD / 7443551470; Value: 732-1128-1-ND; Rule: UNIONINDEX=0|RULEKIND=PolygonConnect|NETSCOPE=AnyNet|LAYERKIND=SameLayer|NAME=Schematic Polygon Connect Style|THPAD.CONNECTSTYLE=Relief|THPAD.RELIEFCONDUCTORWIDTH=39.3701mil|THPAD.RELIEFENTRIES=4|THPAD.POLYGONRELIEFANGLE=90 Angle|THPAD.AIRGAPWIDTH=5.9055mil|SMDPAD.CONNECTSTYLE=Relief|SMDPAD.RELIEFCONDUCTORWIDTH=39.3701mil|SMDPAD.RELIEFENTRIES=4|SMDPAD.POLYGONRELIEFANGLE=90 Angle|SMDPAD.AIRGAPWIDTH=5.9055mil|VIA.CONNECTSTYLE=Relief|VIA.RELIEFCONDUCTORWIDTH=10mil|VIA.RELIEFENTRIES=4|VIA.POLYGONRELIEFANGLE=45 Angle|VIA.AIRGAPWIDTH=10mil|UNIT=Metric; Isat: *; Supplier 1: Digi-Key
Q8 Q9 Q11 Q12 = BSC0502NSIATMA1: as Q5 on sheet power; Value: BSC014N04LSIATMA1; Supplier 1: Digi-Key; Supplier Part Number 1: BSC014N04LSIATMA1CT-ND
Q10 Q13 = Q/FMMT558: TRANS PNP 400V 150MA HV SOT23-3; Value: MMBT3904,215; Supplier 1: Digi-Key
R9 R10 = R: Chip Resistor SMD; Value: RHM.006ALCT; Rule: UNIONINDEX=0|RULEKIND=PolygonConnect|NETSCOPE=AnyNet|LAYERKIND=SameLayer|NAME=Schematic Polygon Connect Style|CONNECTSTYLE=Relief|RELIEFCONDUCTORWIDTH=39.3701mil|RELIEFENTRIES=4|POLYGONRELIEFANGLE=90 Angle|AIRGAPWIDTH=5.9055mil|UNIT=Metric; Supplier 1: Digi-Key; Supplier Part Number 1: RHM.006ALCT-ND
R11-R13 R16-R20 R24 R25 R33 R37 R38 R40-R42 R52 R53 R55 R56 R60 R61 = R: Chip Resistor SMD
  R11 R12 R17-R20 R25 R37 R38: Value: 10k
  R13 R16: Value: 1k
  R24: Value: 0
  R33: Value: 17.8k; Supplier 1: Digi-Key
  R40-R42: Value: 2
  R52 R53 R55 R56: Value: 100
  R60 R61: Value: DNP
R26 = R: 2019-TLR2HWDTE3L00F75CT-ND; Rule: UNIONINDEX=0|RULEKIND=PolygonConnect|NETSCOPE=AnyNet|LAYERKIND=SameLayer|NAME=Schematic Polygon Connect Style|CONNECTSTYLE=Relief|RELIEFCONDUCTORWIDTH=39.3701mil|RELIEFENTRIES=4|POLYGONRELIEFANGLE=90 Angle|AIRGAPWIDTH=5.9055mil|UNIT=Metric; Supplier 1: Digi-Key; Supplier Part Number 1: 2019-TLR2HWDTE3L00F75CT-ND; Value: TLR2HWDTE3L00F75
R30 = R: Chip Resistor SMD; Value: RC0603FR-0720KL; Supplier 1: Digi-Key
R43 = R: 2019-TLR2HWDTE3L00F75CT-ND; Rule: UNIONINDEX=0|RULEKIND=PolygonConnect|NETSCOPE=AnyNet|LAYERKIND=SameLayer|NAME=Schematic Polygon Connect Style|CONNECTSTYLE=Relief|RELIEFCONDUCTORWIDTH=39.3701mil|RELIEFENTRIES=4|POLYGONRELIEFANGLE=45 Angle|AIRGAPWIDTH=5.9055mil|UNIT=Metric; Supplier 1: Digi-Key; Supplier Part Number 1: 2019-TLR2HWDTE3L00F75CT-ND; Value: TLR2HWDTE3L00F75
TP1 TP3-TP6 = TP: Test Point
U4 = LTC3886: Supplier 1: Mouser; Value: LTC3886-1

## Nets that join several sheets
+3.3V: power (29 pins), dcdc (9 pins)
+5V: power (6 pins), dcdc (11 pins)
+5VINT: power (C58.2 U6.8), dcdc (5 pins)
+12V: power (D4.1 J4.1 J6.1 J8.1), dcdc (9 pins)
+VMAIN: power (16 pins), dcdc (7 pins)
GND: power (82 pins), dcdc (53 pins)
EN-5V: power (U2.22), dcdc (R18.2 TP6.1 U4.20)
EN-12V: power (Q4.3 R28.1), dcdc (R17.2 TP1.1 U4.19)
nALERT: power (U2.14), dcdc (J9.6 R25.1 U4.16)
nFAULT-5V: power (U2.24), dcdc (R20.1 U4.18)
nFAULT-12V: power (U2.27), dcdc (R12.1 U4.17)
PGOOD-5V: power (U2.25), dcdc (R11.1 U4.33)
PGOOD-12V: power (U2.23), dcdc (R19.1 U4.34)
PSU_I2C.SCL: power (5 pins), dcdc (J9.4 U4.14)
PSU_I2C.SDA: power (5 pins), dcdc (J9.2 U4.15)